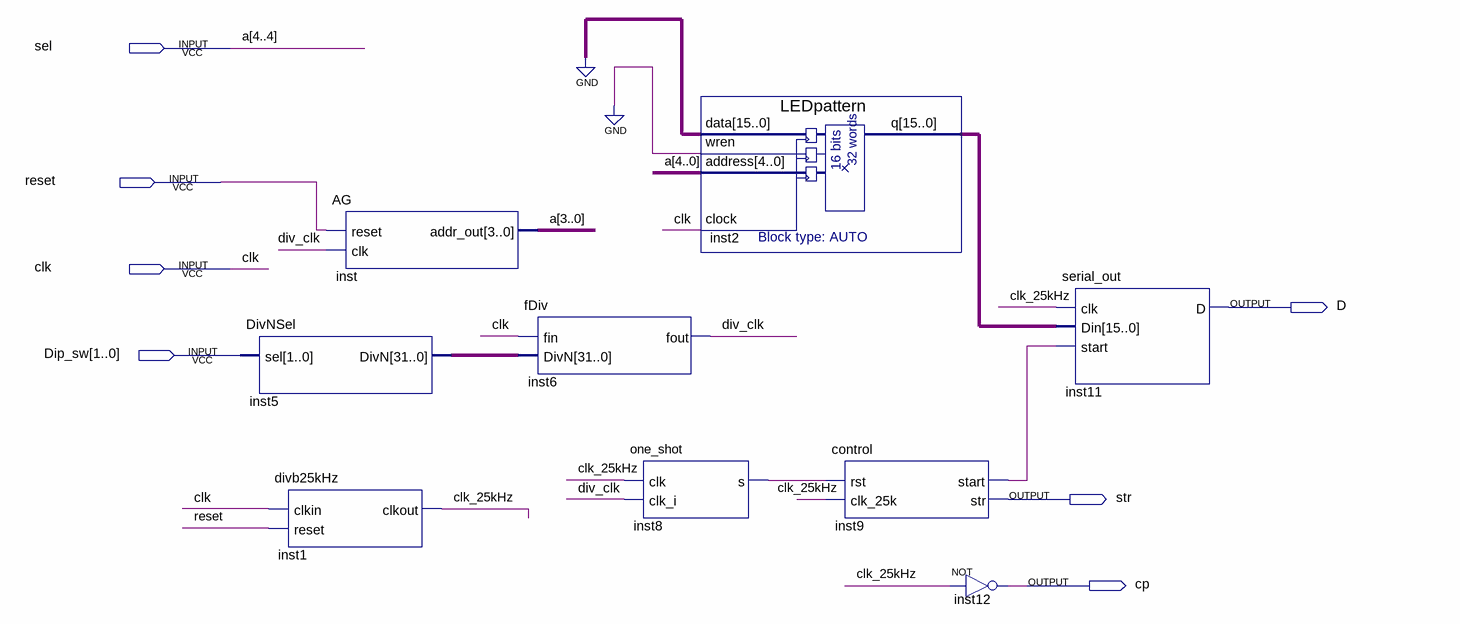
[diagram p0: schematic sheet]
// Quartus schematic BlockDiagram.bdf as structural Verilog: 9 symbols, 7 pins
module BlockDiagram (
  input  sel,
  input  reset,
  input  clk,
  input  [1:0] Dip_sw,
  output D,
  output str,
  output cp
);

  wire clk_25kHz, div_clk, inst8_s, inst9_start;
  wire [3:0] a;
  wire [15:0] inst2_q;
  wire [31:0] inst5_divn;

  DivNSel inst5 (.sel(Dip_sw), .DivN(inst5_divn));
  divb25kHz inst1 (.clkin(clk), .reset(reset), .clkout(clk_25kHz));
  AG inst (.reset(reset), .clk(div_clk), .addr_out(a));
  fDiv inst6 (.fin(clk), .DivN(inst5_divn), .fout(div_clk));
  one_shot inst8 (.clk(clk_25kHz), .clk_i(div_clk), .s(inst8_s));
  LEDpattern inst2 (.data({16{1'b0}}), .wren(1'b0), .address({sel, a}), .clock(clk), .q(inst2_q));
  control inst9 (.rst(inst8_s), .clk_25k(clk_25kHz), .start(inst9_start), .str(str));
  not inst12 (cp, clk_25kHz);
  serial_out inst11 (.clk(clk_25kHz), .Din(inst2_q), .start(inst9_start), .D(D));

  // Other names for the same wires on the sheet: a[4] = sel
endmodule
